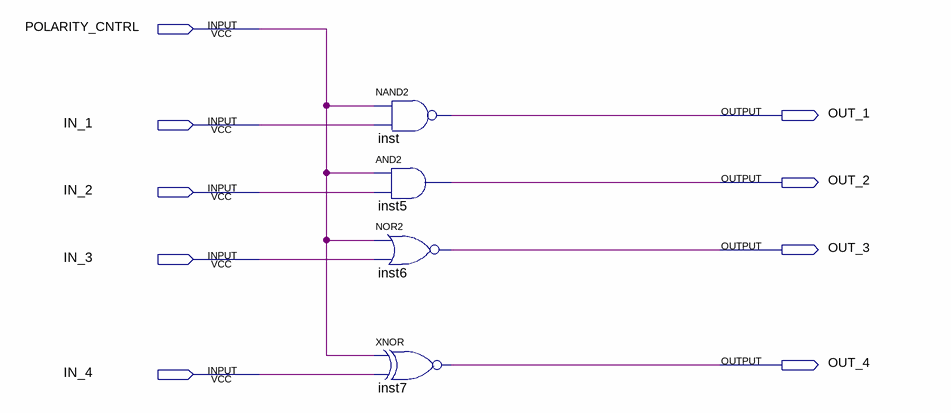
[diagram p0: schematic sheet]
// Quartus schematic PolarityChangeControl.bdf as structural Verilog: 4 symbols, 9 pins
module PolarityChangeControl (
  input  POLARITY_CNTRL,
  input  IN_1,
  input  IN_2,
  input  IN_3,
  input  IN_4,
  output OUT_1,
  output OUT_2,
  output OUT_3,
  output OUT_4
);

  nand inst (OUT_1, POLARITY_CNTRL, IN_1);
  and inst5 (OUT_2, POLARITY_CNTRL, IN_2);
  nor inst6 (OUT_3, POLARITY_CNTRL, IN_3);
  xnor inst7 (OUT_4, POLARITY_CNTRL, IN_4);
endmodule
